# EAGLE design bopit (EAGLE 9.6.2)
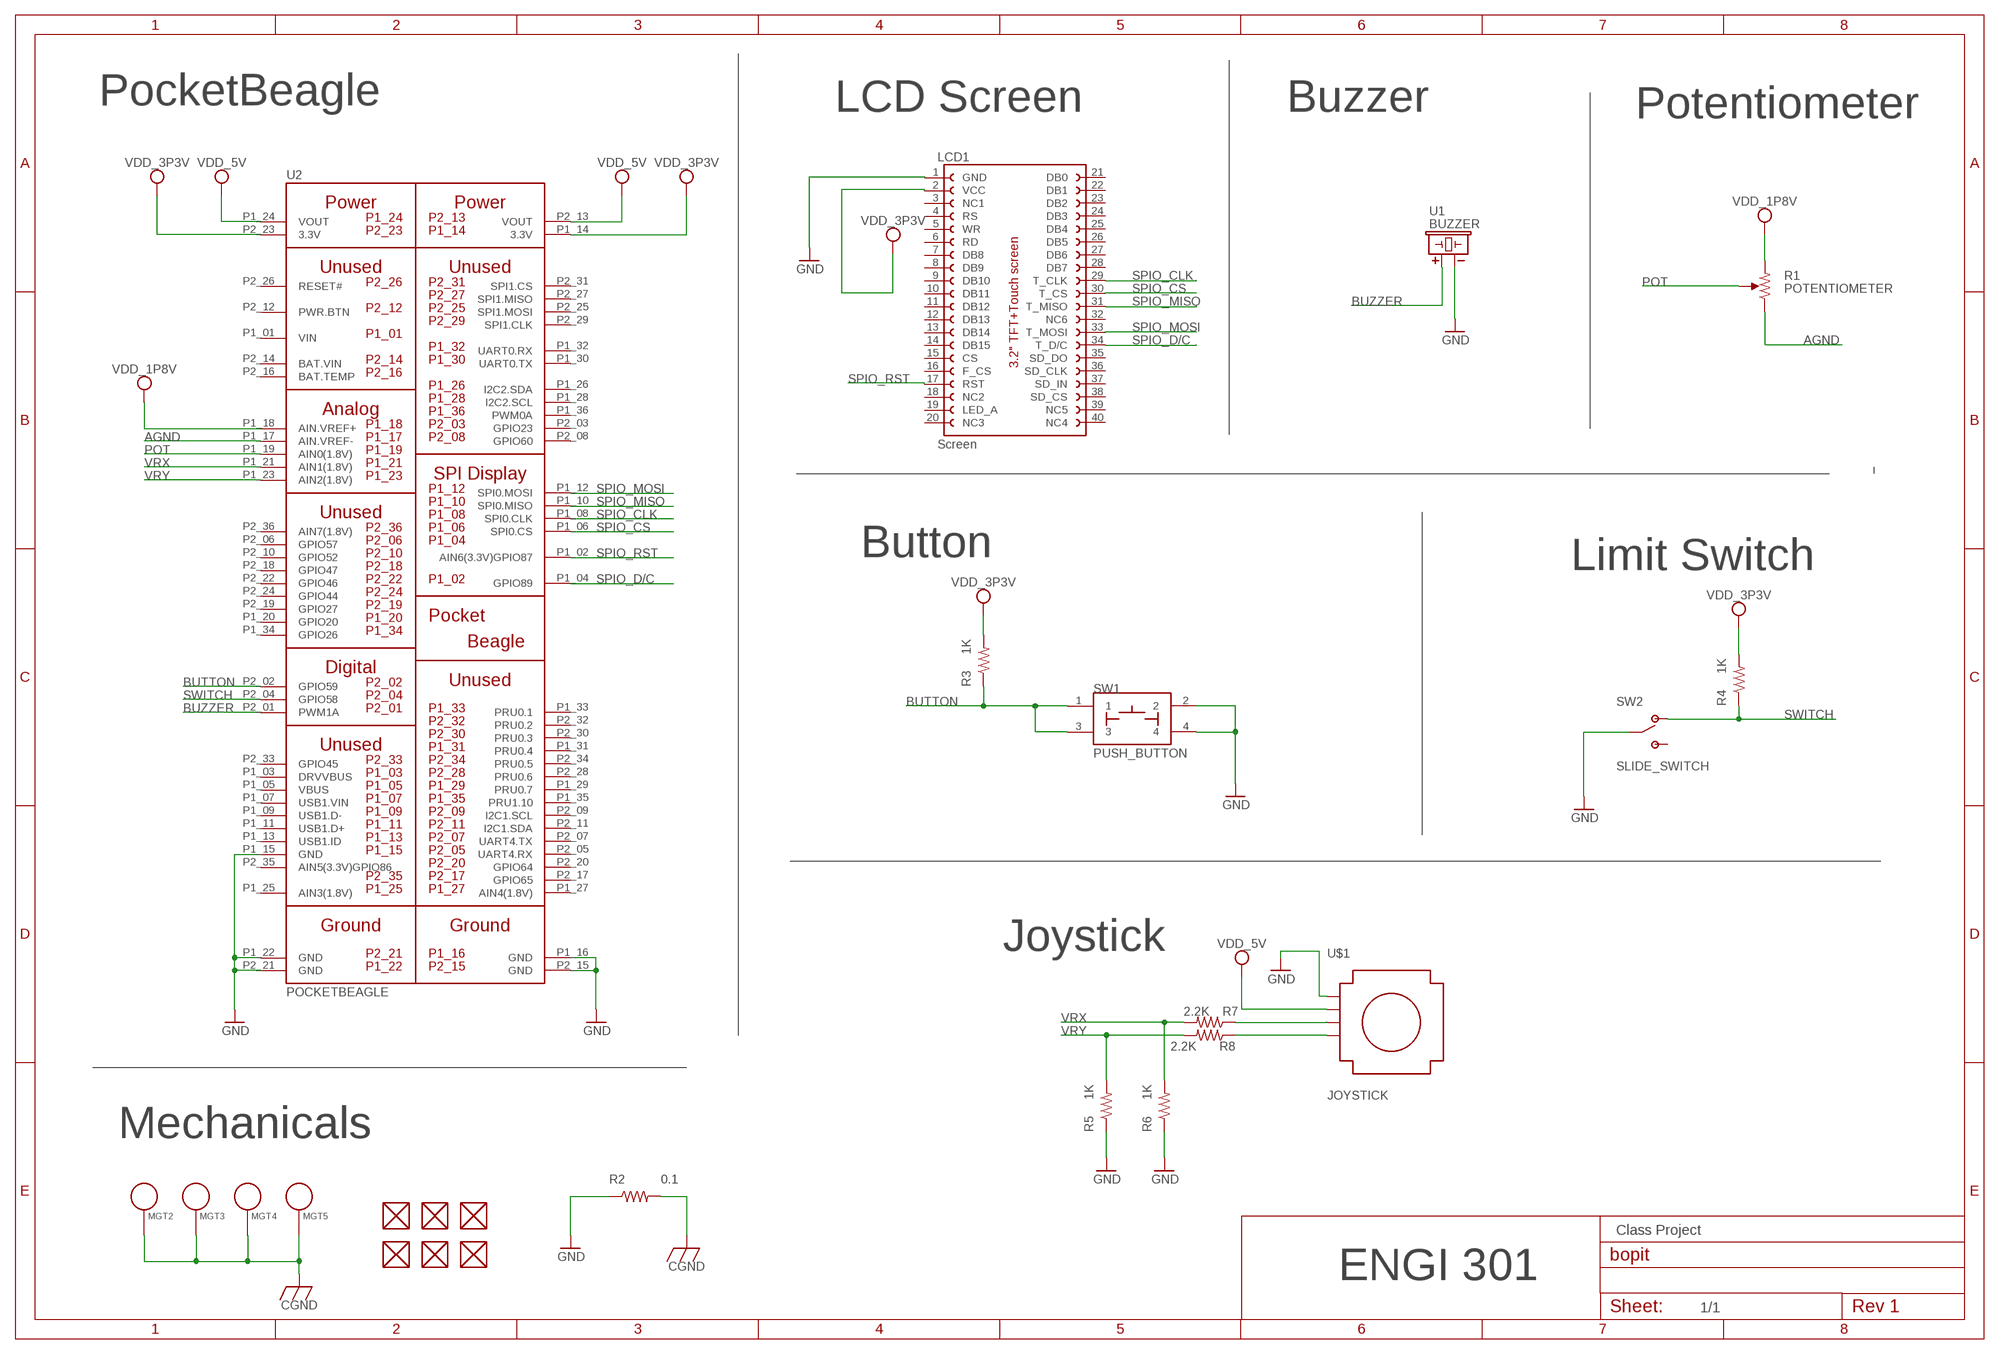
[diagram p0: schematic, sheet 1]

## Parts
FUD1  FIDUCIAL  [FIDUCIAL_40MIL]
FUD2  FIDUCIAL  [FIDUCIAL_40MIL]
FUD3  FIDUCIAL  [FIDUCIAL_40MIL]
FUD4  FIDUCIAL  [FIDUCIAL_40MIL]
FUD5  FIDUCIAL  [FIDUCIAL_40MIL]
FUD6  FIDUCIAL  [FIDUCIAL_40MIL]
LCD1  Screen  LCD_TFT_320QVT9341  [LCD_TFT_9341_MIRROR]
MGT2  MOUNTING_HOLE  [MOUNTING_HOLE]
MGT3  MOUNTING_HOLE  [MOUNTING_HOLE]
MGT4  MOUNTING_HOLE  [MOUNTING_HOLE]
MGT5  MOUNTING_HOLE  [MOUNTING_HOLE]
R1  POTENTIOMETER  [POT-PO90S]
R2  0.1  R_R0603  [R0603]
R3  1K  R_R0603  [R0603]
R4  1K  R_R0603  [R0603]
R5  1K  R_R0603  [R0603]
R6  1K  R_R0603  [R0603]
R7  2.2K  R_R0603  [R0603]
R8  2.2K  R_R0603  [R0603]
SW1  PUSH_BUTTON  [BUTTON_12.5MM]
SW2  SLIDE_SWITCH  [JS202011SCQN]
U1  BUZZER  [BUZZER_6.5MM]
U2  POCKETBEAGLE  [POCKETBEAGLE]
U$1  JOYSTICK  [EIA-JSTK]

## Nets
AGND: R1.CCW U2.P1_17(AIN.VREF-)
BUTTON: R3.1 SW1.1 SW1.3 U2.P2_02(GPIO59)
BUZZER: U1.+ U2.P2_01(PWM1A)
CGND: MGT2.P$1 MGT3.P$1 MGT4.P$1 MGT5.P$1 R2.2
GND: LCD1.1(GND) R2.1 R5.1 R6.1 SW1.2 SW1.4 SW2.2(COMM) SW2.5(COMM) U1.- U2.P1_15(GND) U2.P1_16(GND) U2.P1_22(GND) U2.P2_15(GND) U2.P2_21(GND) U$1.2(GND)
N$1: R7.1 U$1.3(VRX)
N$2: R8.1 U$1.4(VRY)
POT: R1.S U2.P1_19(AIN0(1.8V))
SPIO_CLK: LCD1.29(T_CLK) U2.P1_08(SPI0.CLK)
SPIO_CS: LCD1.30(T_CS) U2.P1_06(SPI0.CS)
SPIO_D/C: LCD1.34(T_D/C) U2.P1_04(GPIO89)
SPIO_MISO: LCD1.31(T_MISO) U2.P1_10(SPI0.MISO)
SPIO_MOSI: LCD1.33(T_MOSI) U2.P1_12(SPI0.MOSI)
SPIO_RST: LCD1.17(RST) U2.P1_02(AIN6(3.3V)GPIO87)
SWITCH: R4.1 SW2.1(POS1) SW2.4(POS1) U2.P2_04(GPIO58)
VDD_1P8V: R1.CW U2.P1_18(AIN.VREF+)
VDD_3P3V: LCD1.2(VCC) R3.2 R4.2 U2.P1_14(3.3V) U2.P2_23(3.3V)
VDD_5V: U2.P1_24(VOUT) U2.P2_13(VOUT) U$1.1(5V)
VRX: R6.2 R7.2 U2.P1_21(AIN1(1.8V))
VRY: R5.2 R8.2 U2.P1_23(AIN2(1.8V))
Unconnected: FUD1.P$1 FUD2.P$1 FUD3.P$1 FUD4.P$1 FUD5.P$1 FUD6.P$1 LCD1.3(NC1) LCD1.4(RS) LCD1.5(WR) LCD1.6(RD) LCD1.7(DB8) LCD1.8(DB9) LCD1.9(DB10) LCD1.10(DB11) LCD1.11(DB12) LCD1.12(DB13) LCD1.13(DB14) LCD1.14(DB15) LCD1.15(CS) LCD1.16(F_CS) LCD1.18(NC2) LCD1.19(LED_A) LCD1.20(NC3) LCD1.21(DB0) LCD1.22(DB1) LCD1.23(DB2) LCD1.24(DB3) LCD1.25(DB4) LCD1.26(DB5) LCD1.27(DB6) LCD1.28(DB7) LCD1.32(NC6) LCD1.35(SD_DO) LCD1.36(SD_CLK) LCD1.37(SD_IN) LCD1.38(SD_CS) LCD1.39(NC5) LCD1.40(NC4) SW2.3(POS2) SW2.6(POS2) U2.P1_03(DRVVBUS) U2.P1_05(VBUS) U2.P1_07(USB1.VIN) U2.P1_09(USB1.D-) U2.P1_11(USB1.D+) U2.P1_13(USB1.ID) U2.P1_20(GPIO20) U2.P1_25(AIN3(1.8V)) U2.P1_26(I2C2.SDA) U2.P1_27(AIN4(1.8V)) U2.P1_28(I2C2.SCL) U2.P1_29(PRU0.7) U2.P1_30(UART0.TX) U2.P1_31(PRU0.4) U2.P1_32(UART0.RX) U2.P1_33(PRU0.1) U2.P1_34(GPIO26) U2.P1_35(PRU1.10) U2.P1_36(PWM0A) U2.P2_03(GPIO23) U2.P2_05(UART4.RX) U2.P2_06(GPIO57) U2.P2_07(UART4.TX) U2.P2_08(GPIO60) U2.P2_09(I2C1.SCL) U2.P2_10(GPIO52) U2.P2_11(I2C1.SDA) U2.P2_12(PWR.BTN) U2.P2_16(BAT.TEMP) U2.P2_17(GPIO65) U2.P2_18(GPIO47) U2.P2_19(GPIO27) U2.P2_20(GPIO64) U2.P2_22(GPIO46) U2.P2_24(GPIO44) U2.P2_25(SPI1.MOSI) U2.P2_26(RESET#) U2.P2_27(SPI1.MISO) U2.P2_28(PRU0.6) U2.P2_29(SPI1.CLK) U2.P2_30(PRU0.3) U2.P2_31(SPI1.CS) U2.P2_32(PRU0.2) U2.P2_33(GPIO45) U2.P2_34(PRU0.5) U2.P2_35(AIN5(3.3V)GPIO86) U2.P2_36(AIN7(1.8V))

## Notes on the sheet
- PocketBeagle | LCD Screen | Buzzer | Potentiometer
- Button | Limit Switch
- Joystick
- Mechanicals
- Class Project
- ENGI 301
- 1/1

## Power pins joined to a net without a drawn wire
BAT.VIN: U2.P2_14(BAT.VIN)
VIN: U2.P1_01(VIN)

## Library data of the parts
FUD1-FUD6 = bopit:FIDUCIAL
LCD1 = bopit:LCD_TFT_320QVT: 3.2" 320x240 TFT Module Display Touch Panel with PCB 262K Colors IC SSD1289
MGT2-MGT5 = bopit:MOUNTING_HOLE: Chassis Mounting Hole w/GND connection ability
R1 = bopit:POTENTIOMETER: Potentiometer - Examples: P090S-14T20BR10K (987-1277-ND)
R2-R8 = bopit:R_: RESISTOR, American symbol
SW1 = bopit:PUSH_BUTTON
SW2 = bopit:SLIDE_SWITCH: JS202011SCQN SPDT Slide Switch
U1 = bopit:BUZZER: CEM-1203 Buzzer
U2 = bopit:POCKETBEAGLE
U$1 = bopit:JOYSTICK: Joystick Layout

## Board
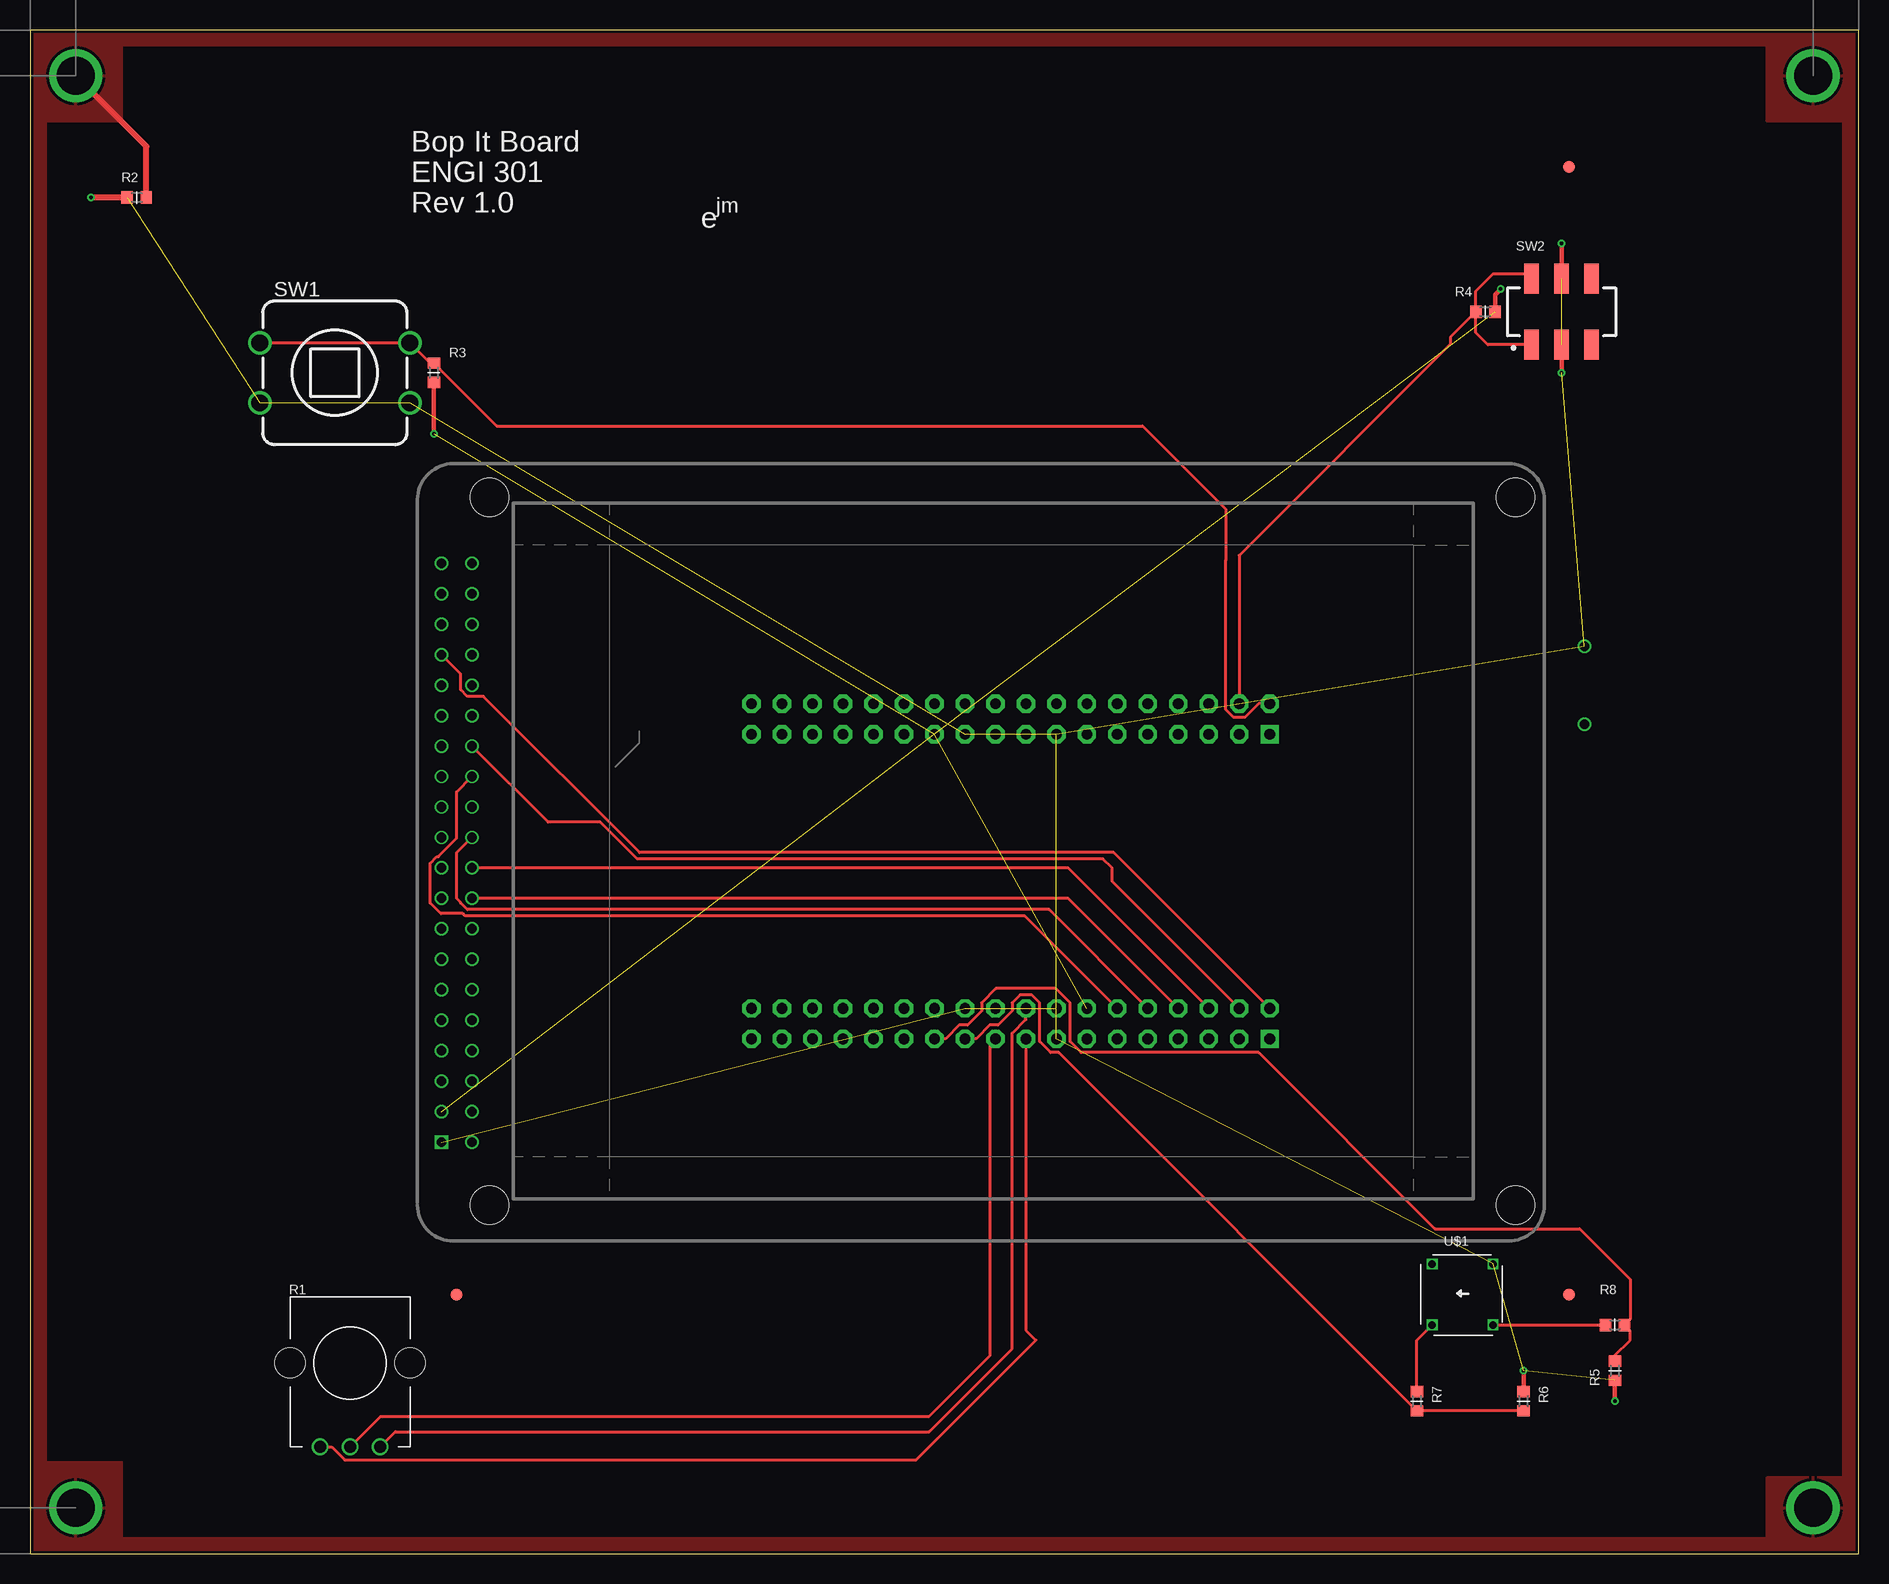
[diagram p1: board, top side]
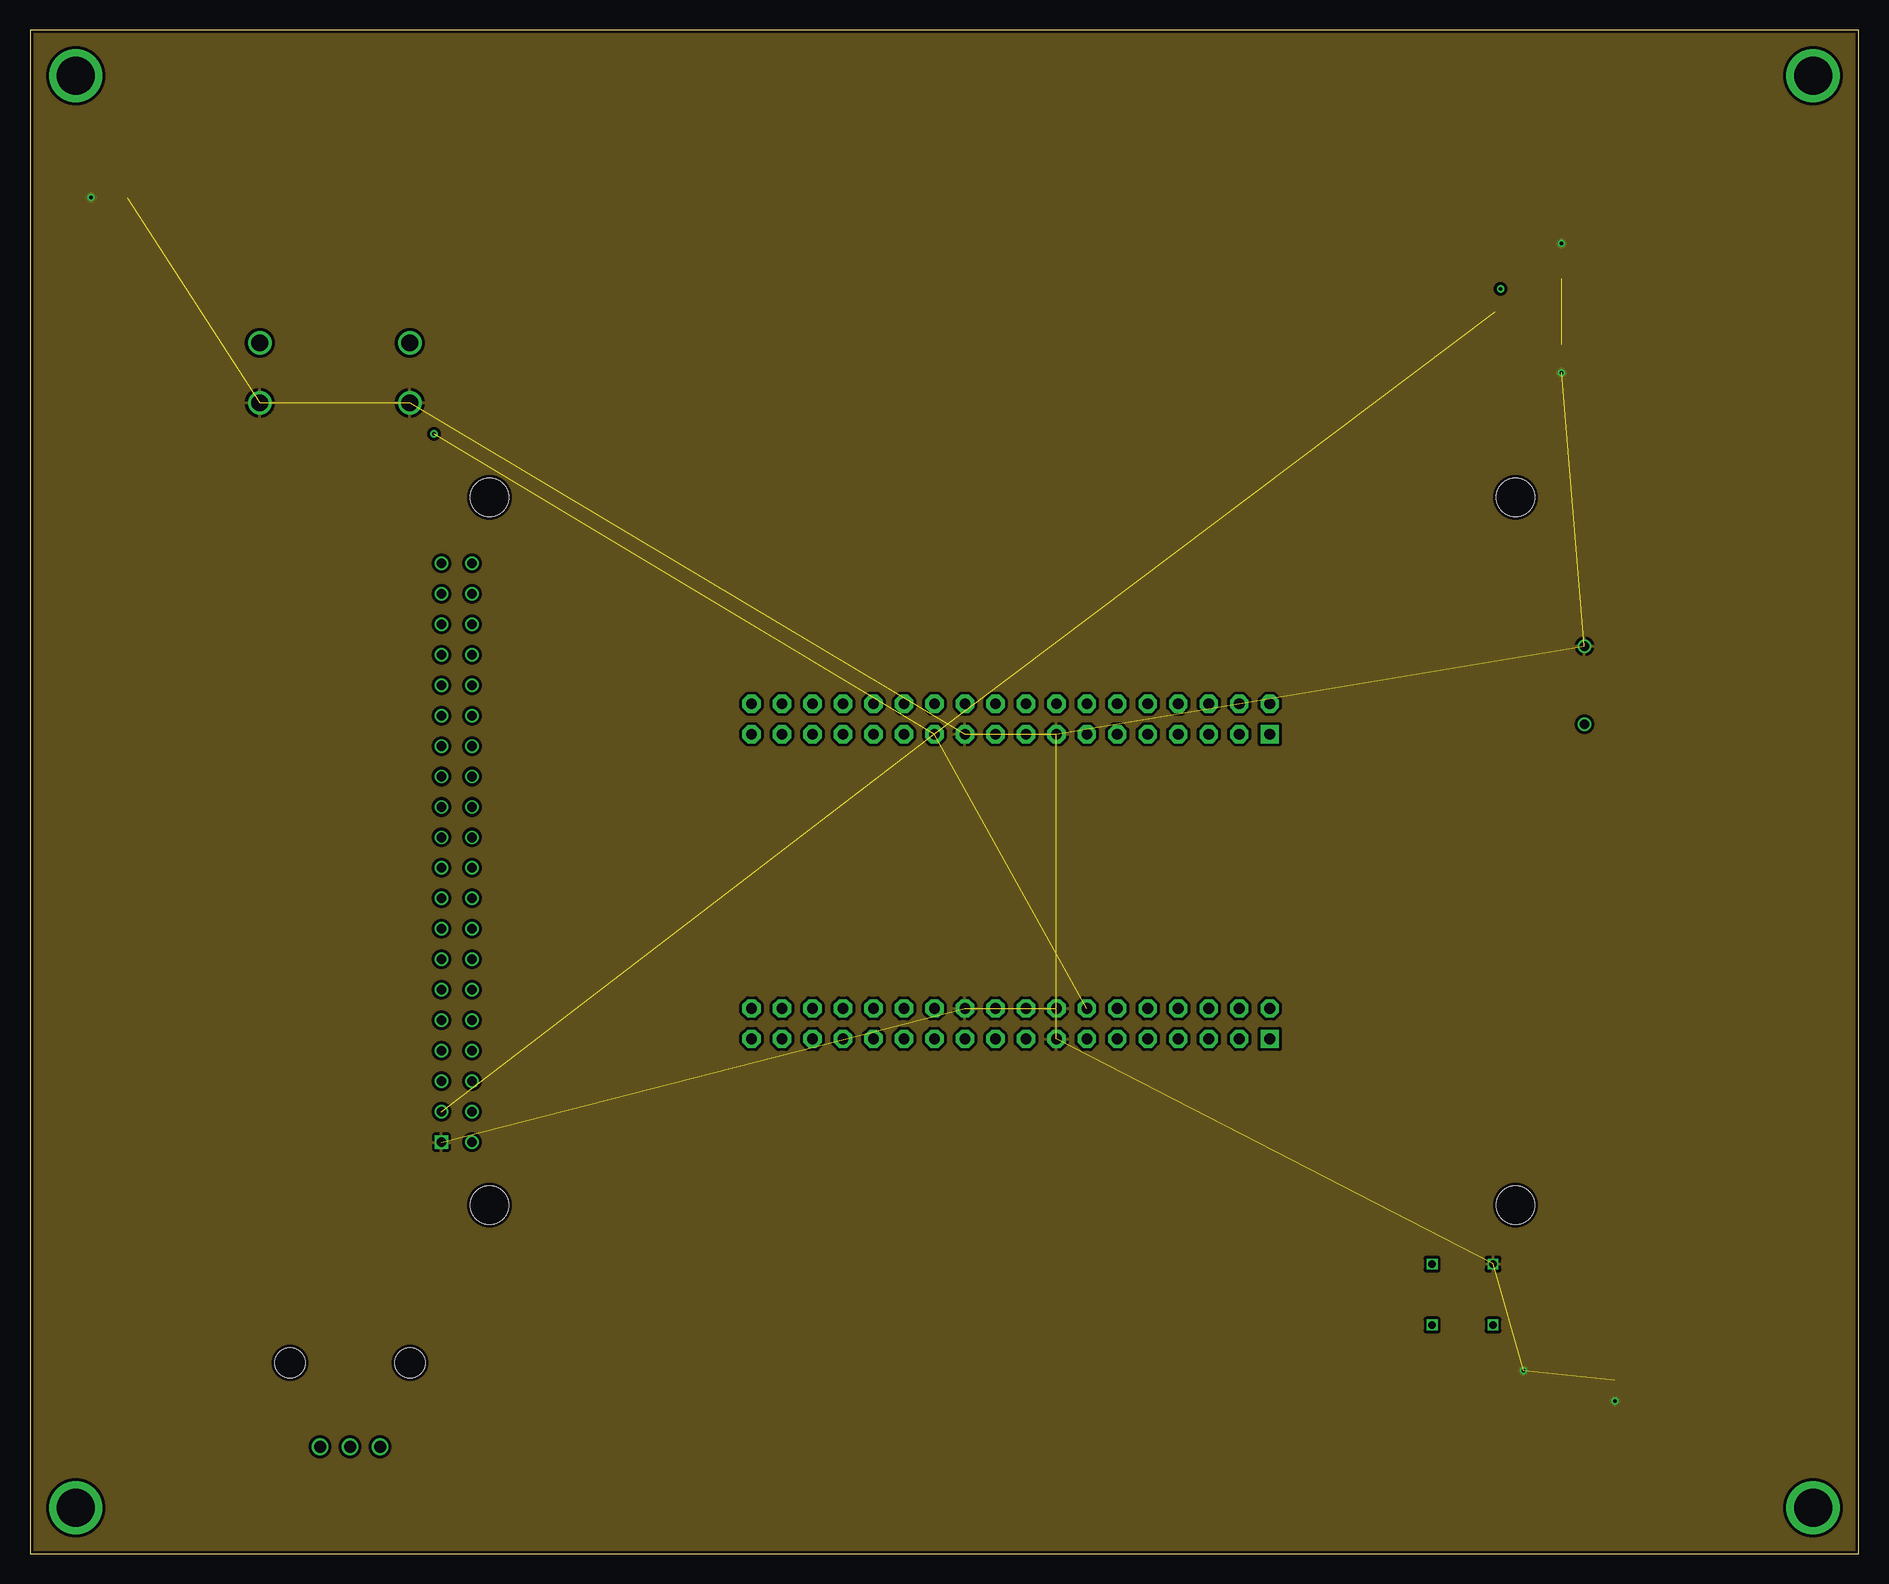
[diagram p2: board, inner layer Route2]
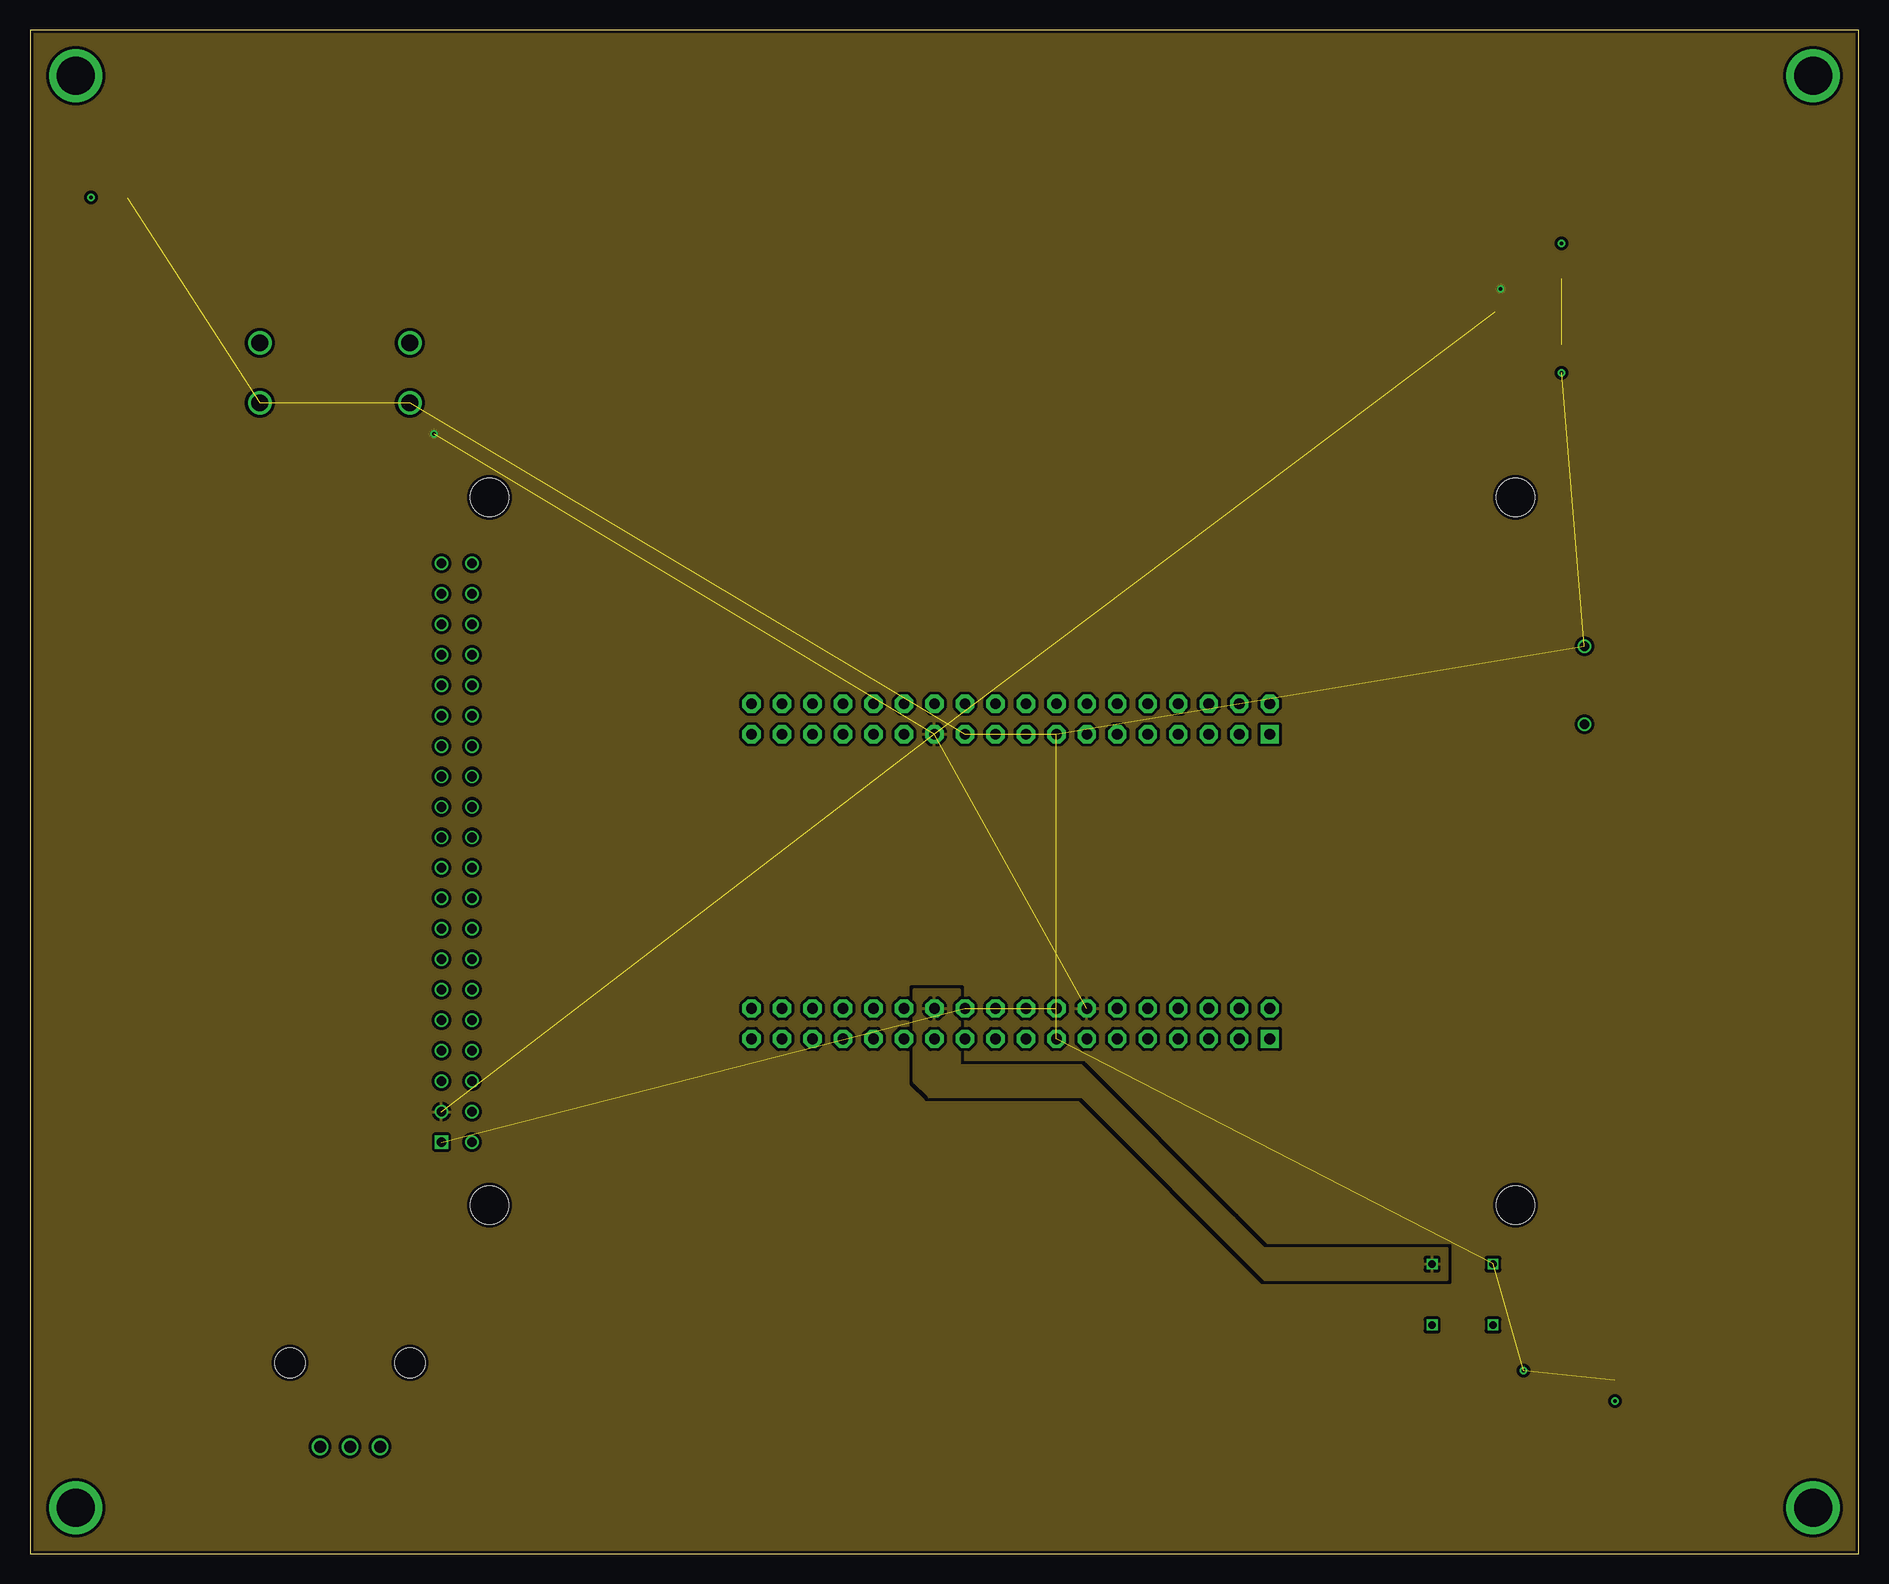
[diagram p3: board, inner layer Route15]
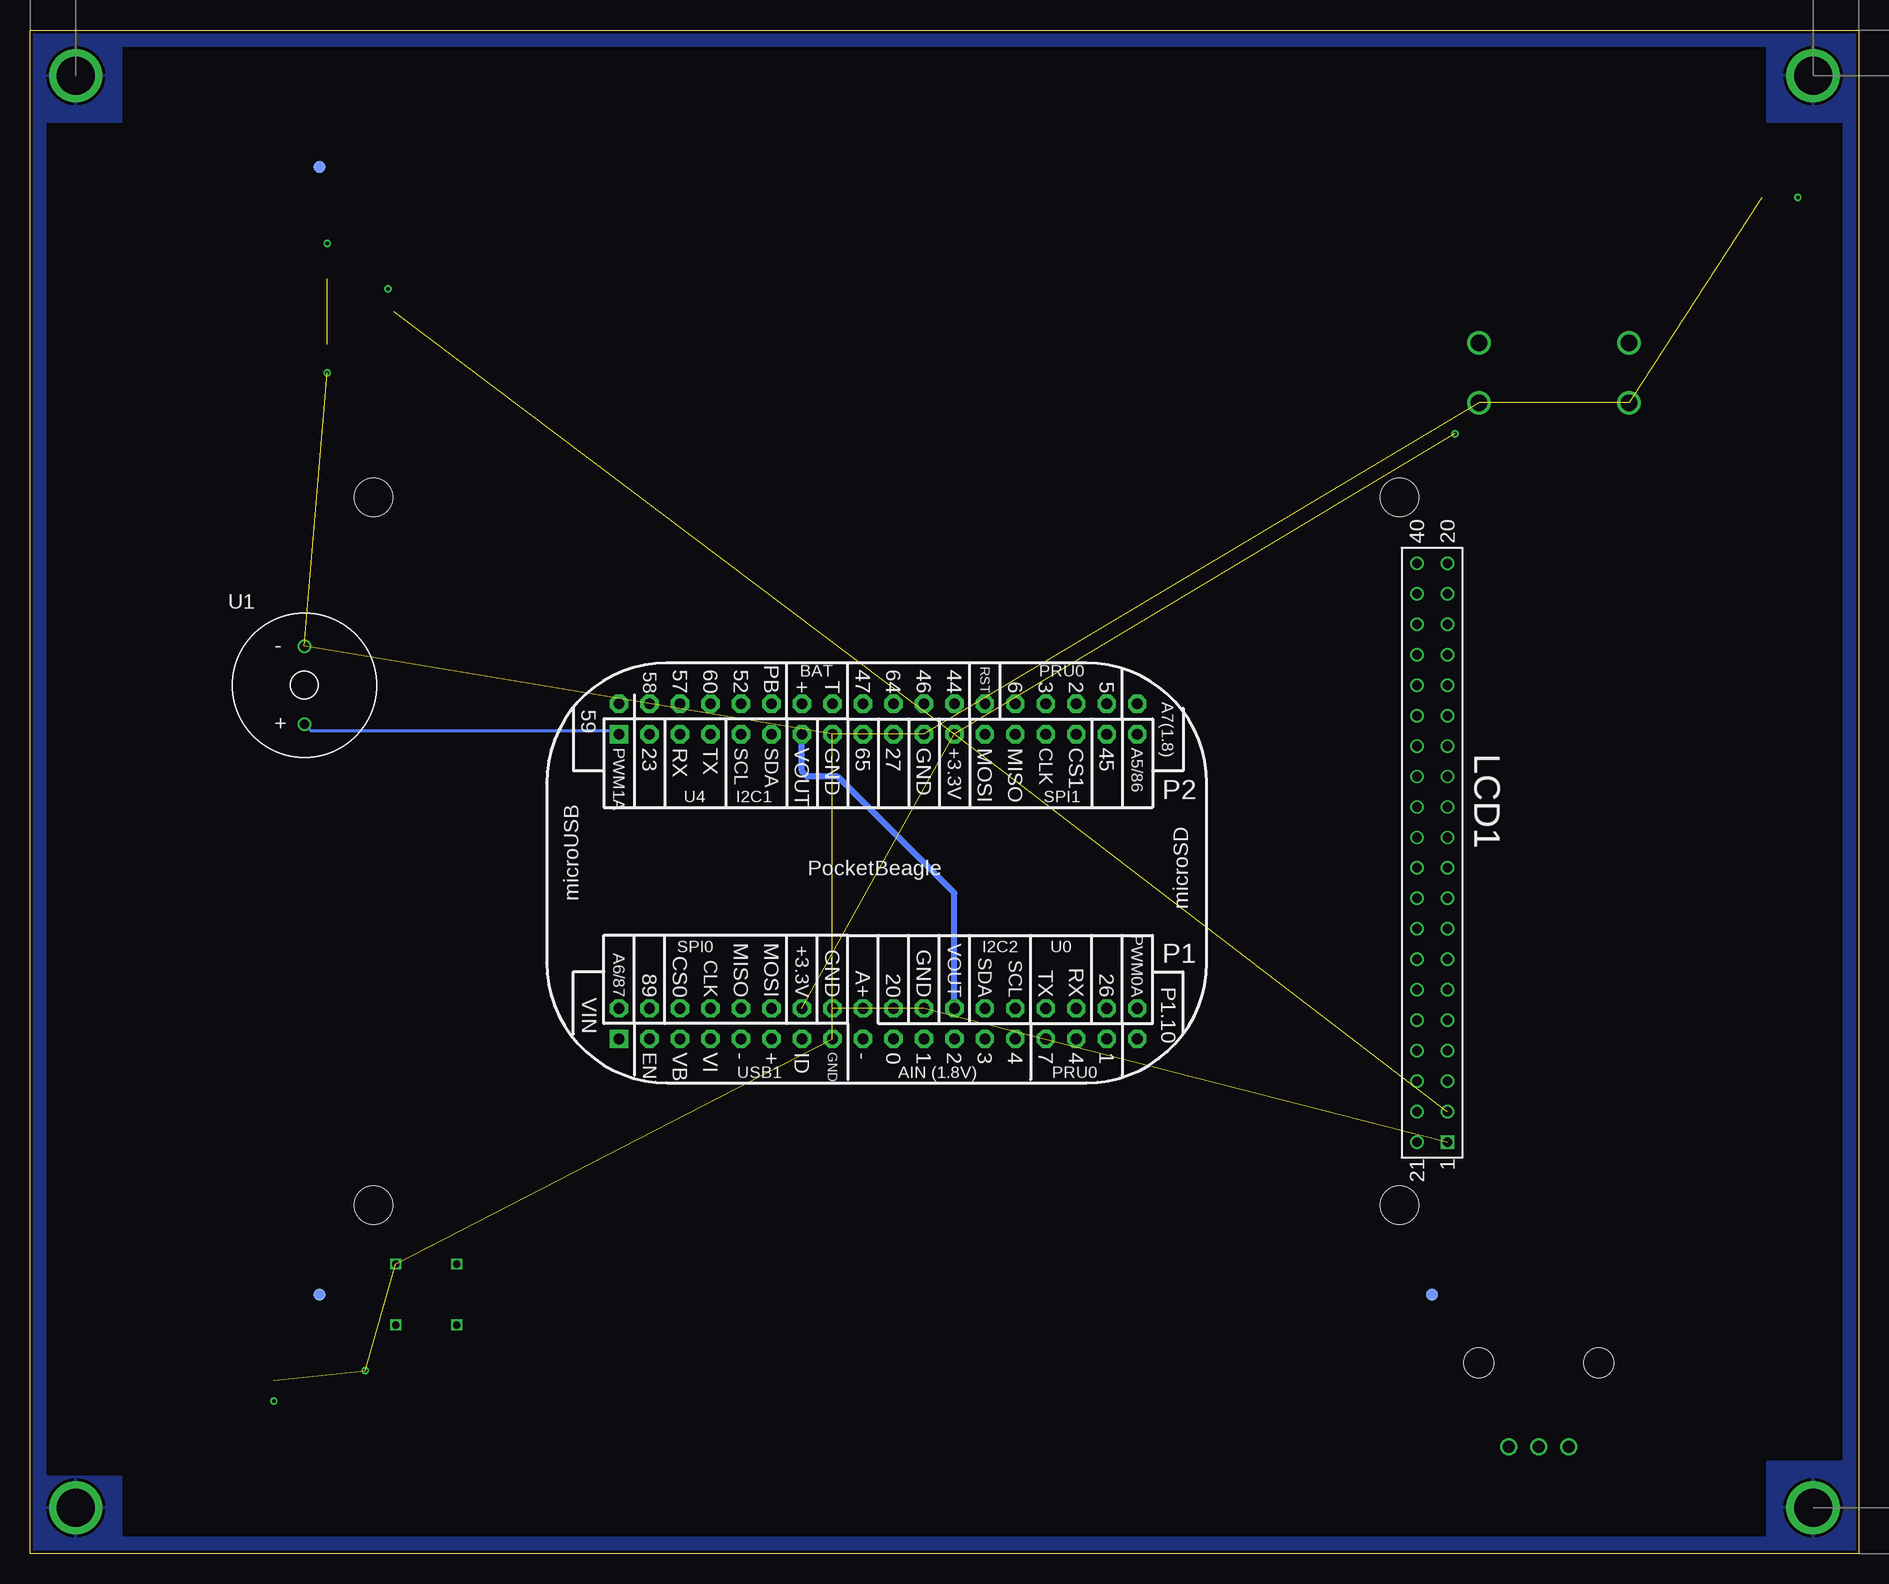
[diagram p4: board, bottom side, seen from below]

Size 152.4 x 127 mm. Coordinates in mm from the lower left corner, seen from the top.
Outline: 0,0 152.4,0 152.4,127 0,127 0,0
Copper layers (1*2*15*16): Top 0.035mm / dielectric 0.23mm / Route2 0.035mm / dielectric 0.93mm / Route15 0.035mm / dielectric 0.23mm / Bottom 0.035mm
Design rules "ENGI301_4lyr": minimum track width 10mil, minimum drill 12mil, track to track 10mil, track to pad 10mil, pad to pad 10mil, via to via 10mil, smd to smd 10mil, copper to edge 10mil, drill to drill 12mil, minimum pad ring 6mil, minimum via ring 6mil, stop-mask expansion 3mil, vias tented up to drill 25mil, thermal gap 10mil

### Footprints (pad centres in the part's own frame; a part is rotated, then mirrored left to right if it is on the bottom)
FIDUCIAL_40MIL = smd 1.016 x 1.016: P$1 0,0
LCD_TFT_9341_MIRROR = drill 0.8 square: 1 48.26,0 | drill 0.8: 2 45.72,0; 3 43.18,0; 4 40.64,0; 5 38.1,0; 6 35.56,0; 7 33.02,0; 8 30.48,0; 9 27.94,0; 10 25.4,0; 11 22.86,0; 12 20.32,0; 13 17.78,0; 14 15.24,0; 15 12.7,0; 16 10.16,0; 17 7.62,0; 18 5.08,0; 19 2.54,0; 20 0,0; 21 48.26,2.54; 22 45.72,2.54; 23 43.18,2.54; 24 40.64,2.54; 25 38.1,2.54; 26 35.56,2.54; 27 33.02,2.54; 28 30.48,2.54; 29 27.94,2.54; 30 25.4,2.54; 31 22.86,2.54; 32 20.32,2.54; 33 17.78,2.54; 34 15.24,2.54; 35 12.7,2.54; 36 10.16,2.54; 37 7.62,2.54; 38 5.08,2.54; 39 2.54,2.54; 40 0,2.54 | hole 3.2: -5.5,4; 53.5,4; -5.5,89.5; 53.5,89.5
MOUNTING_HOLE = drill 3.175 pad 4.445: P$1 0,0
POT-PO90S = drill 1: CCW -2.5,0; CW 2.5,0; S 0,0 | hole 2.5: -5,7; 5,7
R0603 = smd 0.95 x 1.031: 1 -0.8,0; 2 0.8,0
BUTTON_12.5MM = drill 1.4: 1 -6.25,2.5; 2 -6.25,-2.5; 3 6.25,2.5; 4 6.25,-2.5
JS202011SCQN = smd 1.2 x 2.5: 1 -2.5,-2.75; 2 0,-2.75; 3 2.5,-2.75; 4 -2.5,2.75; 5 0,2.75; 6 2.5,2.75
BUZZER_6.5MM = drill 0.8: + 0,-3.25; - 0,3.25
POCKETBEAGLE = drill 0.889 pad 1.524 square: P1_01 5.91,3.53; P2_01 5.91,28.93 | drill 0.889 pad 1.524 octagon: P1_02 5.91,6.07; P1_03 8.45,3.53; P1_04 8.45,6.07; P1_05 10.99,3.53; P1_06 10.99,6.07; P1_07 13.53,3.53; P1_08 13.53,6.07; P1_09 16.07,3.53; P1_10 16.07,6.07; P1_11 18.61,3.53; P1_12 18.61,6.07; P1_13 21.15,3.53; P1_14 21.15,6.07; P1_15 23.69,3.53; P1_16 23.69,6.07; P1_17 26.23,3.53; P1_18 26.23,6.07; P1_19 28.77,3.53; P1_20 28.77,6.07; P1_21 31.31,3.53; P1_22 31.31,6.07; P1_23 33.85,3.53; P1_24 33.85,6.07; P1_25 36.39,3.53; P1_26 36.39,6.07; P1_27 38.93,3.53; P1_28 38.93,6.07; P1_29 41.47,3.53; P1_30 41.47,6.07; P1_31 44.01,3.53; P1_32 44.01,6.07; P1_33 46.55,3.53; P1_34 46.55,6.07; P1_35 49.09,3.53; P1_36 49.09,6.07; P2_02 5.91,31.47; P2_03 8.45,28.93; P2_04 8.45,31.47; P2_05 10.99,28.93; P2_06 10.99,31.47; P2_07 13.53,28.93; P2_08 13.53,31.47; P2_09 16.07,28.93; P2_10 16.07,31.47; P2_11 18.61,28.93; P2_12 18.61,31.47; P2_13 21.15,28.93; P2_14 21.15,31.47; P2_15 23.69,28.93; P2_16 23.69,31.47; P2_17 26.23,28.93; P2_18 26.23,31.47; P2_19 28.77,28.93; P2_20 28.77,31.47; P2_21 31.31,28.93; P2_22 31.31,31.47; P2_23 33.85,28.93; P2_24 33.85,31.47; P2_25 36.39,28.93; P2_26 36.39,31.47; P2_27 38.93,28.93; P2_28 38.93,31.47; P2_29 41.47,28.93; P2_30 41.47,31.47; P2_31 44.01,28.93; P2_32 44.01,31.47; P2_33 46.55,28.93; P2_34 46.55,31.47; P2_35 49.09,28.93; P2_36 49.09,31.47
EIA-JSTK = drill 0.6 square: 1 -2.54,2.54; 2 2.54,2.54; 3 -2.54,-2.54; 4 2.54,-2.54

### Placement (x,y rotation side)
FUD1  128.27,115.57 0 top
FUD2  128.27,21.59 0 top
FUD3  35.56,21.59 0 top
FUD4  128.27,115.57 0 bottom
FUD5  128.27,21.59 0 bottom
FUD6  35.56,21.59 0 bottom
LCD1  34.29,82.55 270 top
MGT2  3.81,123.19 0 top
MGT3  148.59,123.19 0 top
MGT4  148.59,3.81 0 top
MGT5  3.81,3.81 0 top
R1  26.67,8.89 0 top
R2  8.89,113.03 0 top
R3  33.66,98.42 270 top
R4  121.28,103.5 0 top
R5  132.08,15.24 90 top
R6  124.46,12.7 270 top
R7  115.57,12.7 270 top
R8  132.08,19.05 0 top
SW1  25.4,98.42 0 top
SW2  127.64,103.5 0 top
U1  129.54,72.39 0 bottom
U2  109.22,39.37 0 bottom
U$1  119.38,21.59 0 top

### Tracks (layer width: path | path; a pad name or v marks a point on that pad's centre or on a via)
AGND
  Top 0.254: R1.CCW 25.14,8.89 26.22,7.81 73.85,7.81 83.82,17.78 82.99,18.61 U2.P1_17
BUTTON
  Top 0.254: SW1.1 SW1.3 33.35,99.22 R3.1 38.9,93.98 92.71,93.98 99.63,87.06 99.63,82.78 99.63,82.55 99.63,70.37 100.3,69.7 101.24,69.7 102.39,70.84 U2.P2_02
BUZZER
  Bottom 0.254: U2.P2_01 103.59,68.58 128.98,68.58 U1.+
CGND
  Top 0.508: R2.2 9.69,117.31 MGT2.P$1
  pour Top: -1.27,63.5 -1.27,128.27 153.67,128.27 153.67,63.5 151.13,63.5 151.13,119.38 144.78,119.38 144.78,125.73 7.62,125.73 7.62,119.38 1.27,119.38 1.27,63.5
  pour Top: -1.27,63.5 1.27,63.5 1.27,7.62 7.62,7.62 7.62,1.27 144.78,1.27 144.78,6.35 151.13,6.35 151.13,63.5 153.67,63.5 153.67,-1.27 -1.27,-1.27
  pour Bottom: 1.27,63.5 -1.27,63.5 -1.27,128.27 153.67,128.27 153.67,63.5 151.13,63.5 151.13,119.38 144.78,119.38 144.78,125.73 7.62,125.73 7.62,119.38 1.27,119.38
  pour Bottom: -1.27,63.5 1.27,63.5 1.27,7.62 7.62,7.62 7.62,1.27 144.78,1.27 144.78,6.35 151.13,6.35 151.13,63.5 153.67,63.5 153.67,-1.27 -1.27,-1.27
GND  (via drill 0.3 pad 0.61)  (14 unrouted)
  Top 0.381: R5.1 v132.08,12.7 | SW2.2 v127.64,98.42 | SW2.5 v127.64,109.22 | R6.1 v124.46,15.24
  Top 0.508: R2.1 v5.08,113.03
  pour Route2: -2.54,129.54 154.94,129.54 154.94,-2.54 -2.54,-2.54
N$1
  Top 0.254: R7.1 115.57,17.78 U$1.3
N$2
  Top 0.254: U$1.4 R8.1
POT
  Top 0.254: R1.S 29.21,11.43 74.93,11.43 80.01,16.51 80.01,42.46 U2.P1_19
SPIO_CLK
  Top 0.254: U2.P1_08 86.52,54.61 LCD1.29
SPIO_CS
  Top 0.254: U2.P1_06 86.52,57.15 LCD1.30
SPIO_D/C
  Top 0.254: U2.P1_04 90.17,56.04 90.17,57.15 89.41,57.91 50.59,57.91 47.54,60.96 43.18,60.96 LCD1.34
SPIO_MISO
  Top 0.254: U2.P1_10 84.92,53.67 36.44,53.67 35.89,54.22 35.89,54.28 35.56,54.61 35.56,58.42 LCD1.31
SPIO_MOSI
  Top 0.254: U2.P1_12 82.89,53.16 36.23,53.16 36.05,53.34 34.23,53.34 33.35,54.22 33.35,57.54 33.9,58.09 34.02,58.09 35.56,59.63 35.56,63.5 LCD1.33
SPIO_RST
  Top 0.254: U2.P1_02 90.33,58.42 50.8,58.42 37.77,71.45 36.44,71.45 35.89,72 35.89,73.33 LCD1.17
SWITCH
  Top 0.254: SW2.1 121.5,100.75 120.48,101.77 R4.1 | R4.1 118.37,101.39 118.37,100.8 100.77,83.2 U2.P2_04 | SW2.4 124.71,106.68 121.92,106.68 120.48,105.25 R4.1
VDD_1P8V
  Top 0.254: R1.CW 30.44,10.16 74.93,10.16 81.85,17.08 81.85,43.37 82.99,44.52 U2.P1_18
VDD_3P3V  (via drill 0.3 pad 0.61)  (4 unrouted)
  Top 0.381: R3.2 v33.66,93.34 | R4.2 122.08,104.94 v122.56,105.41
  pour Route15 (rank 6): -3.81,130.81 156.21,130.81 156.21,-3.81 -3.81,-3.81
VDD_5V
  Bottom 0.508: U2.P1_24 75.37,55.05 85.09,64.77 87.63,64.77 88.07,65.21 U2.P2_13
  pour Route15: 118.11,22.86 118.11,25.4 102.87,25.4 100.33,27.94 87.63,40.64 77.47,40.64 77.47,46.99 73.66,46.99 73.66,39.37 74.93,38.1 83.82,38.1 87.63,38.1 102.87,22.86
VRX
  Top 0.254: R6.2 R7.2 85.71,41.76 85.06,41.76 84.13,42.68 84.13,45.91 83.46,46.58 82.52,46.58 81.85,45.91 81.85,45.22 80.67,44.04 79.98,44.04 78.83,42.9 U2.P1_21
VRY
  Top 0.254: U2.P1_23 76.29,42.9 77.44,44.04 78.13,44.04 79.31,45.22 79.31,45.91 80.48,47.09 85.5,47.09 86.67,45.91 86.67,42.68 87.6,41.76 102.39,41.76 117.08,27.07 129.14,27.07 133.35,22.86 133.35,19.52 R8.2 133.35,18.58 133.35,17.78 132.08,16.51 R5.2

### Text on the board
tPlace: Bop It Board | ENGI 301 | Rev 1.0 | jm | e